# Altium project Pixhawk-BEC-Module.PrjPcb (part 2 of 3)
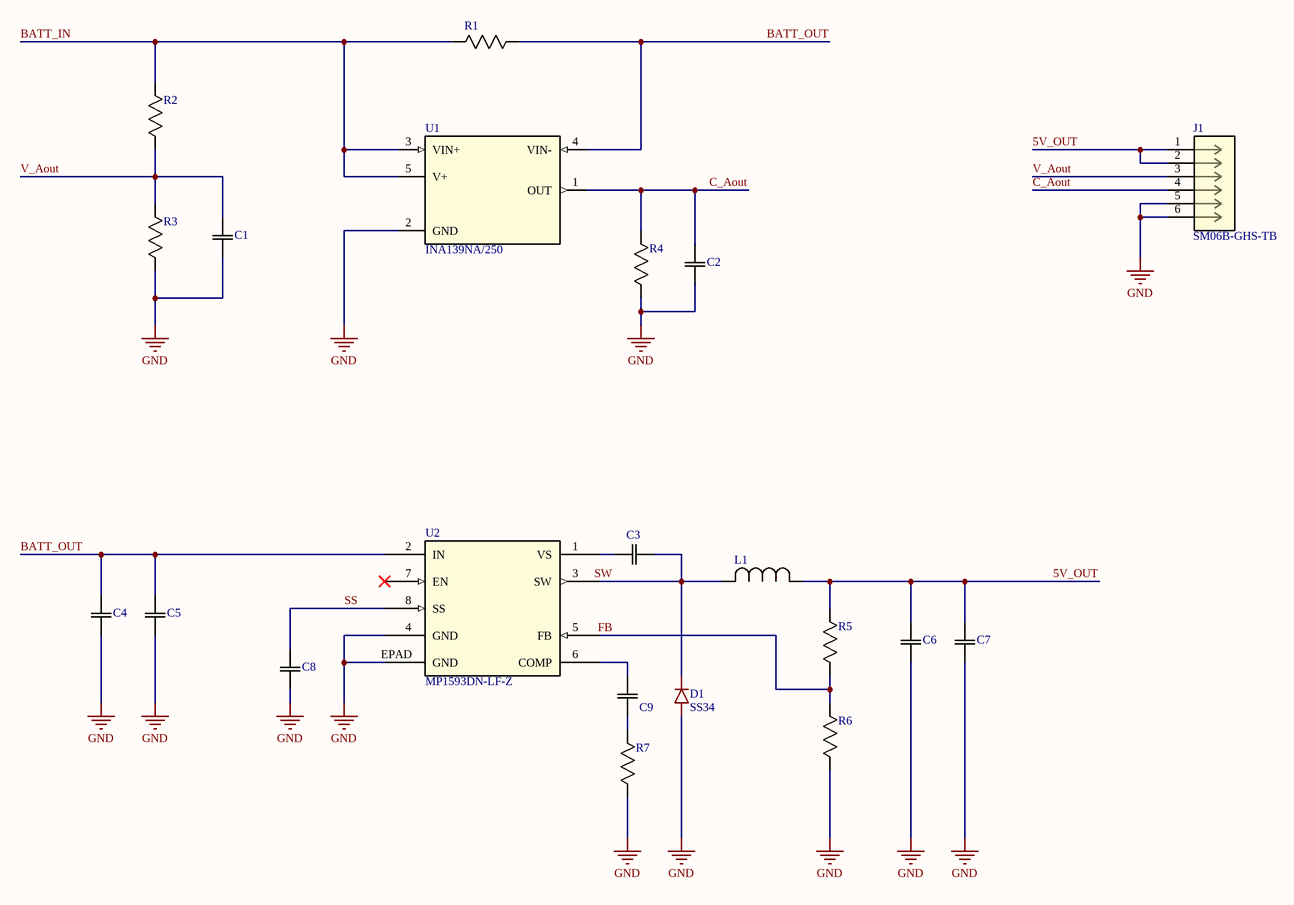
[diagram p1: Sheet1.SchDoc]

## Sheet Sheet1.SchDoc (continued)
### Library data of the parts
C1 C2 C8 = CC0402KRX7R9BB104: 50V 100nF X7R ±10% 0402 Multilayer Ceramic Capacitors MLCC - SMD/SMT ROHS; Manufacturer: Yageo Group; Temperature Coefficient: 30ppm/°C; Supplier: DigiKey; Supplier Part Number: 311-3566-1-ND; Manufacturer Part Number: CC0402KRX7R9BB104; RoHS: Compliant; Category: Ceramic Capacitors; Stock: 948996; Pricing: 1=0.08, 10=0.025, 50=0.0168, 100=0.012, 500=0.01084 (USD); Value: 100nF; Case/Package: 0402; China RoHS: Compliant; Dielectric: X7R; Dielectric Material: Ceramic; Halogen Free: Halogen Free; Height: 500µm; Lead Free: Lead Free; Length: 1mm; Lifecycle Status: Production; Material: Ceramic; Max Operating Temperature: 125°C; Min Operating Temperature: -55°C; Mounting Technology: Surface Mount; Number of Terminals: 2; REACH SVHC: Yes; Schedule B: 8532240020, 8532240020|8532240020, 8532240020|8532240020|8532240020, 8532240020|8532240020|8532240020|8532240020; Thickness: 558.8µm; Tolerance: 10%; Voltage Rating: 50V; Voltage Rating (DC): 50V; Width: 500µm; ComponentLink1URL: https://datasheet.octopart.com:443/CC0402KRX7R9BB104-Yageo-datasheet-177165144.pdf?src-supplier=IHS; ComponentLink1Description: https://datasheet.octopart.com:443/CC0402KRX7R9BB104-Yageo-datasheet-177165144.pdf?src-supplier=IHS; ComponentLink2URL: https://datasheet.octopart.com:443/CC0402KRX7R9BB104-Yageo-datasheet-78855684.pdf?src-supplier=Upverter; ComponentLink2Description: https://datasheet.octopart.com:443/CC0402KRX7R9BB104-Yageo-datasheet-78855684.pdf?src-supplier=Upverter; ComponentLink3URL: https://datasheet.octopart.com:443/CC0402KRX7R9BB104-Yageo-datasheet-181967451.pdf?src-supplier=Newark; ComponentLink3Description: https://datasheet.octopart.com:443/CC0402KRX7R9BB104-Yageo-datasheet-181967451.pdf?src-supplier=Newark; ComponentLink4URL: https://datasheet.octopart.com:443/CC0402KRX7R9BB104-Yageo-datasheet-140260305.pdf?src-supplier=Newark; ComponentLink4Description: https://datasheet.octopart.com:443/CC0402KRX7R9BB104-Yageo-datasheet-140260305.pdf?src-supplier=Newark; ComponentLink5URL: https://datasheet.octopart.com:443/CC0402KRX7R9BB104-Yageo-datasheet-147453679.pdf?src-supplier=Farnell; ComponentLink5Description: https://datasheet.octopart.com:443/CC0402KRX7R9BB104-Yageo-datasheet-147453679.pdf?src-supplier=Farnell; ComponentLink6URL: https://datasheet.octopart.com/CC0402KRX7R9BB104-Yageo-datasheet-10883670.pdf; ComponentLink6Description: https://datasheet.octopart.com/CC0402KRX7R9BB104-Yageo-datasheet-10883670.pdf; ComponentLink7URL: https://datasheet.octopart.com/Surface-Mount-Ceramic-Multilayer-Capacitors%3B-General-Purpose-%26-High-Capacitance-Class-2%2C-X7R-Yageo-datasheet-family-114.pdf; ComponentLink7Description: https://datasheet.octopart.com/Surface-Mount-Ceramic-Multilayer-Capacitors%3B-General-Purpose-%26-High-Capacitance-Class-2%2C-X7R-Yageo-datasheet-family-114.pdf; ComponentLink8URL: https://datasheet.octopart.com:443/CC0402KRX7R9BB104-Yageo-datasheet-166511530.pdf?src-supplier=Future+Electronics; ComponentLink8Description: https://datasheet.octopart.com:443/CC0402KRX7R9BB104-Yageo-datasheet-166511530.pdf?src-supplier=Future+Electronics; ComponentLink9URL: https://datasheet.octopart.com:443/CC0402KRX7R9BB104-Yageo-datasheet-137700082.pdf?src-supplier=Future+Electronics; ComponentLink9Description: https://datasheet.octopart.com:443/CC0402KRX7R9BB104-Yageo-datasheet-137700082.pdf?src-supplier=Future+Electronics; ComponentLink10URL: https://datasheet.octopart.com:443/CC0402KRX7R9BB104-Yageo-datasheet-137700084.pdf?src-supplier=Future+Electronics; ComponentLink10Description: https://datasheet.octopart.com:443/CC0402KRX7R9BB104-Yageo-datasheet-137700084.pdf?src-supplier=Future+Electronics; ComponentLink11URL: https://datasheet.octopart.com:443/CC0402KRX7R9BB104-Yageo-datasheet-42079887.pdf?src-supplier=Future+Electronics; ComponentLink11Description: https://datasheet.octopart.com:443/CC0402KRX7R9BB104-Yageo-datasheet-42079887.pdf?src-supplier=Future+Electronics; ComponentLink12URL: https://datasheet.octopart.com:443/CC0402KRX7R9BB104-Yageo-datasheet-178018857.pdf?src-supplier=Burklin+Elektronik; ComponentLink12Description: https://datasheet.octopart.com:443/CC0402KRX7R9BB104-Yageo-datasheet-178018857.pdf?src-supplier=Burklin+Elektronik; ComponentLink13URL: https://datasheet.octopart.com:443/CC0402KRX7R9BB104-Yageo-Group-datasheet-165992755.pdf?src-supplier=ODG+(Origin+Data+Global); ComponentLink13Description: https://datasheet.octopart.com:443/CC0402KRX7R9BB104-Yageo-Group-datasheet-165992755.pdf?src-supplier=ODG+(Origin+Data+Global); ComponentLink14URL: https://datasheet.octopart.com:443/CC0402KRX7R9BB104-Yageo-datasheet-151948686.pdf?src-supplier=TME; ComponentLink14Description: https://datasheet.octopart.com:443/CC0402KRX7R9BB104-Yageo-datasheet-151948686.pdf?src-supplier=TME; ComponentLink15URL: https://datasheet.octopart.com:443/CC0402KRX7R9BB104-Yageo-datasheet-120101875.pdf?src-supplier=Megastar; ComponentLink15Description: https://datasheet.octopart.com:443/CC0402KRX7R9BB104-Yageo-datasheet-120101875.pdf?src-supplier=Megastar; ComponentLink16URL: http://sigma.octopart.com:80/rohs_statement/Surface-Mount-Ceramic-Multilayer-Capacitors%3B-General-Purpose-%26-High-Capacitance-Class-2%2C-X7R-Yageo-family-124.pdf?src-supplier=Compliance+Statements; ComponentLink16Description: http://sigma.octopart.com:80/rohs_statement/Surface-Mount-Ceramic-Multilayer-Capacitors%3B-General-Purpose-%26-High-Capacitance-Class-2%2C-X7R-Yageo-family-124.pdf?src-supplier=Compliance+Statements; ComponentLink17URL: http://sigma.octopart.com:80/reach_statement/Surface-Mount-Ceramic-Multilayer-Capacitors%3B-General-Purpose-%26-High-Capacitance-Class-2%2C-X7R-Yageo-family-125.pdf?src-supplier=Compliance+Statements; ComponentLink17Description: http://sigma.octopart.com:80/reach_statement/Surface-Mount-Ceramic-Multilayer-Capacitors%3B-General-Purpose-%26-High-Capacitance-Class-2%2C-X7R-Yageo-family-125.pdf?src-supplier=Compliance+Statements; ComponentLink18URL: http://sigma.octopart.com:80/conflict_mineral_statement/Yageo-company-3.pdf?src-supplier=Compliance+Statements; ComponentLink18Description: http://sigma.octopart.com:80/conflict_mineral_statement/Yageo-company-3.pdf?src-supplier=Compliance+Statements; ComponentLink19URL: http://sigma.octopart.com:80/rohs_statement/Yageo-company-2.pdf?src-supplier=Compliance+Statements; ComponentLink19Description: http://sigma.octopart.com:80/rohs_statement/Yageo-company-2.pdf?src-supplier=Compliance+Statements
C3 C9 = C0402C103K5RACTU: Multilayer Ceramic Capacitors MLCC - SMD/SMT 50V 0.01uF X7R 0402 10%; Manufacturer: KEMET; Value: 10nF; Dissipation Factor: 2.5%; Supplier: DigiKey; Supplier Part Number: 399-C0402C103K5RACTUDKR-ND; Manufacturer Part Number: C0402C103K5RACTU; RoHS: Compliant; Category: Ceramic Capacitors; Stock: 1084131; Pricing: 1=0.08, 10=0.004 (USD); Case/Package: 0402; Case Code (Imperial): 0402; China RoHS: Compliant; Depth: 500µm; Dielectric: X7R; Dielectric Material: Ceramic; Height: 500µm; Lead Free: Lead Free; Lead Pitch: 300µm; Length: 1mm; Lifecycle Status: Production; Material: Ceramic; Max Operating Temperature: 125°C; Min Operating Temperature: -55°C; Mounting Technology: Surface Mount; Pins: 2; Number of Terminals: 2; Packaging: Cut Tape; Radiation Hardening: No; REACH SVHC: Yes; Schedule B: 8532240020, 8532240020|8532240020, 8532240020|8532240020|8532240020, 8532240020|8532240020|8532240020|8532240020; Termination: SMD/SMT; Thickness: 558.8µm; Tolerance: 10%; Voltage: 50V; Voltage Rating: 50V; Voltage Rating (AC): 50V; Voltage Rating (DC): 50V; Width: 500µm; ComponentLink1URL: https://datasheet.octopart.com:443/C0402C103K5RAC7867-KEMET-datasheet-179093040.pdf?src-supplier=IHS; ComponentLink1Description: https://datasheet.octopart.com:443/C0402C103K5RAC7867-KEMET-datasheet-179093040.pdf?src-supplier=IHS; ComponentLink2URL: https://datasheet.octopart.com:443/C0402C103K5RACTU-KEMET-datasheet-137357759.pdf?src-supplier=Master+Electronics; ComponentLink2Description: https://datasheet.octopart.com:443/C0402C103K5RACTU-KEMET-datasheet-137357759.pdf?src-supplier=Master+Electronics; ComponentLink3URL: https://datasheet.octopart.com:443/C0402C103K5RACTU-KEMET-datasheet-178445679.pdf?src-supplier=Farnell; ComponentLink3Description: https://datasheet.octopart.com:443/C0402C103K5RACTU-KEMET-datasheet-178445679.pdf?src-supplier=Farnell; ComponentLink4URL: https://datasheet.octopart.com:443/C0402C103K5RACTU-KEMET-datasheet-149521615.pdf?src-supplier=Farnell; ComponentLink4Description: https://datasheet.octopart.com:443/C0402C103K5RACTU-KEMET-datasheet-149521615.pdf?src-supplier=Farnell; ComponentLink5URL: https://datasheet.octopart.com:443/C0402C103K5RACTU-KEMET-datasheet-101575465.pdf?src-supplier=Farnell; ComponentLink5Description: https://datasheet.octopart.com:443/C0402C103K5RACTU-KEMET-datasheet-101575465.pdf?src-supplier=Farnell; ComponentLink6URL: https://datasheet.octopart.com:443/C0402C103K5RACTU-KEMET-datasheet-176142082.pdf?src-supplier=Farnell; ComponentLink6Description: https://datasheet.octopart.com:443/C0402C103K5RACTU-KEMET-datasheet-176142082.pdf?src-supplier=Farnell; ComponentLink7URL: https://datasheet.octopart.com:443/C0402C103K5RACTU-Kemet-datasheet-14356739.pdf?src-supplier=Farnell; ComponentLink7Description: https://datasheet.octopart.com:443/C0402C103K5RACTU-Kemet-datasheet-14356739.pdf?src-supplier=Farnell; ComponentLink8URL: https://datasheet.octopart.com:443/C0402C103K5RAC-TU-Kemet-datasheet-7833651.pdf?src-supplier=Farnell; ComponentLink8Description: https://datasheet.octopart.com:443/C0402C103K5RAC-TU-Kemet-datasheet-7833651.pdf?src-supplier=Farnell; ComponentLink9URL: https://datasheet.octopart.com:443/C0402C103K5RAC-TU-Kemet-datasheet-7601896.pdf?src-supplier=Farnell; ComponentLink9Description: https://datasheet.octopart.com:443/C0402C103K5RAC-TU-Kemet-datasheet-7601896.pdf?src-supplier=Farnell; ComponentLink10URL: https://datasheet.octopart.com:443/C0402C103K5RAC-TU-Kemet-datasheet-5316294.pdf?src-supplier=Farnell; ComponentLink10Description: https://datasheet.octopart.com:443/C0402C103K5RAC-TU-Kemet-datasheet-5316294.pdf?src-supplier=Farnell; ComponentLink11URL: https://datasheet.octopart.com:443/C0402C103K5RAC-TU-Kemet-datasheet-5314837.pdf?src-supplier=Farnell; ComponentLink11Description: https://datasheet.octopart.com:443/C0402C103K5RAC-TU-Kemet-datasheet-5314837.pdf?src-supplier=Farnell; ComponentLink12URL: https://datasheet.octopart.com:443/C0402C103K5RAC-TU-Kemet-datasheet-8092359.pdf?src-supplier=Farnell; ComponentLink12Description: https://datasheet.octopart.com:443/C0402C103K5RAC-TU-Kemet-datasheet-8092359.pdf?src-supplier=Farnell; ComponentLink13URL: https://datasheet.octopart.com:443/C0402C103K5RAC-TU-Kemet-datasheet-5314449.pdf?src-supplier=Farnell; ComponentLink13Description: https://datasheet.octopart.com:443/C0402C103K5RAC-TU-Kemet-datasheet-5314449.pdf?src-supplier=Farnell; ComponentLink14URL: https://datasheet.octopart.com:443/C0402C103K5RAC-TU-Kemet-datasheet-5314969.pdf?src-supplier=Farnell; ComponentLink14Description: https://datasheet.octopart.com:443/C0402C103K5RAC-TU-Kemet-datasheet-5314969.pdf?src-supplier=Farnell; ComponentLink15URL: https://datasheet.octopart.com:443/C0402C103K5RAC-TU-Kemet-datasheet-5314627.pdf?src-supplier=Farnell; ComponentLink15Description: https://datasheet.octopart.com:443/C0402C103K5RAC-TU-Kemet-datasheet-5314627.pdf?src-supplier=Farnell; ComponentLink16URL: https://datasheet.octopart.com:443/C0402C103K5RAC-TU-Kemet-datasheet-5389132.pdf?src-supplier=Farnell; ComponentLink16Description: https://datasheet.octopart.com:443/C0402C103K5RAC-TU-Kemet-datasheet-5389132.pdf?src-supplier=Farnell; ComponentLink17URL: https://datasheet.octopart.com:443/C0402C103K5RAC-TU-Kemet-datasheet-5313836.pdf?src-supplier=Farnell; ComponentLink17Description: https://datasheet.octopart.com:443/C0402C103K5RAC-TU-Kemet-datasheet-5313836.pdf?src-supplier=Farnell; ComponentLink18URL: https://datasheet.octopart.com:443/C0402C103K5RAC-TU-Kemet-datasheet-8111010.pdf?src-supplier=Farnell; ComponentLink18Description: https://datasheet.octopart.com:443/C0402C103K5RAC-TU-Kemet-datasheet-8111010.pdf?src-supplier=Farnell; ComponentLink19URL: https://datasheet.octopart.com:443/C0402C103K5RAC-TU-Kemet-datasheet-7627733.pdf?src-supplier=Farnell; ComponentLink19Description: https://datasheet.octopart.com:443/C0402C103K5RAC-TU-Kemet-datasheet-7627733.pdf?src-supplier=Farnell; ComponentLink20URL: https://datasheet.octopart.com:443/C0402C103K5RACTU-Kemet-datasheet-500041.pdf?src-supplier=Farnell; ComponentLink20Description: https://datasheet.octopart.com:443/C0402C103K5RACTU-Kemet-datasheet-500041.pdf?src-supplier=Farnell; ComponentLink21URL: https://datasheet.octopart.com:443/C0402C103K5RAC-TU-Kemet-datasheet-5315946.pdf?src-supplier=Farnell; ComponentLink21Description: https://datasheet.octopart.com:443/C0402C103K5RAC-TU-Kemet-datasheet-5315946.pdf?src-supplier=Farnell; ComponentLink22URL: https://datasheet.octopart.com:443/C0402C103K5RACTU-KEMET-datasheet-32036385.pdf?src-supplier=Electro+Sonic; ComponentLink22Description: https://datasheet.octopart.com:443/C0402C103K5RACTU-KEMET-datasheet-32036385.pdf?src-supplier=Electro+Sonic; ComponentLink23URL: https://datasheet.octopart.com:443/C0402C103K5RACTU-KEMET-datasheet-157246124.pdf?src-supplier=Electro+Sonic; ComponentLink23Description: https://datasheet.octopart.com:443/C0402C103K5RACTU-KEMET-datasheet-157246124.pdf?src-supplier=Electro+Sonic; ComponentLink24URL: https://datasheet.octopart.com:443/C0402C103K5RAC-TU-Kemet-datasheet-5313890.pdf?src-supplier=Newark; ComponentLink24Description: https://datasheet.octopart.com:443/C0402C103K5RAC-TU-Kemet-datasheet-5313890.pdf?src-supplier=Newark; ComponentLink25URL: https://datasheet.octopart.com:443/C0402C103K5RAC-TU-Kemet-datasheet-5390537.pdf?src-supplier=Newark; ComponentLink25Description: https://datasheet.octopart.com:443/C0402C103K5RAC-TU-Kemet-datasheet-5390537.pdf?src-supplier=Newark; ComponentLink26URL: https://datasheet.octopart.com:443/C0402C103K5RAC-TU-Kemet-datasheet-7541751.pdf?src-supplier=Newark; ComponentLink26Description: https://datasheet.octopart.com:443/C0402C103K5RAC-TU-Kemet-datasheet-7541751.pdf?src-supplier=Newark; ComponentLink27URL: https://datasheet.octopart.com:443/C0402C103K5RACTU-KEMET-datasheet-168262798.pdf?src-supplier=Newark; ComponentLink27Description: https://datasheet.octopart.com:443/C0402C103K5RACTU-KEMET-datasheet-168262798.pdf?src-supplier=Newark; ComponentLink28URL: https://datasheet.octopart.com:443/C0402C103K5RACTU-KEMET-datasheet-130256537.pdf?src-supplier=Newark; ComponentLink28Description: https://datasheet.octopart.com:443/C0402C103K5RACTU-KEMET-datasheet-130256537.pdf?src-supplier=Newark; ComponentLink29URL: https://datasheet.octopart.com:443/C0402C103K5RACTU-Kemet-datasheet-8764837.pdf?src-supplier=Newark; ComponentLink29Description: https://datasheet.octopart.com:443/C0402C103K5RACTU-Kemet-datasheet-8764837.pdf?src-supplier=Newark; ComponentLink30URL: https://datasheet.octopart.com:443/C0402C103K5RACTU-Kemet-datasheet-8480123.pdf?src-supplier=Newark; ComponentLink30Description: https://datasheet.octopart.com:443/C0402C103K5RACTU-Kemet-datasheet-8480123.pdf?src-supplier=Newark; ComponentLink31URL: https://datasheet.octopart.com:443/C0402C103K5RACTU-Kemet-datasheet-5393970.pdf?src-supplier=Newark; ComponentLink31Description: https://datasheet.octopart.com:443/C0402C103K5RACTU-Kemet-datasheet-5393970.pdf?src-supplier=Newark; ComponentLink32URL: https://datasheet.octopart.com:443/C0402C103K5RACTU-Kemet-datasheet-8502025.pdf?src-supplier=Newark; ComponentLink32Description: https://datasheet.octopart.com:443/C0402C103K5RACTU-Kemet-datasheet-8502025.pdf?src-supplier=Newark; ComponentLink33URL: https://datasheet.octopart.com:443/C0402C103K5RACTU-Kemet-datasheet-161801.pdf?src-supplier=Newark; ComponentLink33Description: https://datasheet.octopart.com:443/C0402C103K5RACTU-Kemet-datasheet-161801.pdf?src-supplier=Newark; ComponentLink34URL: https://datasheet.octopart.com:443/C0402C103K5RACTU-Kemet-datasheet-12608295.pdf?src-supplier=element14+APAC; ComponentLink34Description: https://datasheet.octopart.com:443/C0402C103K5RACTU-Kemet-datasheet-12608295.pdf?src-supplier=element14+APAC; ComponentLink35URL: https://datasheet.octopart.com:443/C0402C103K5RACTU-Kemet-datasheet-11992184.pdf?src-supplier=element14+APAC; ComponentLink35Description: https://datasheet.octopart.com:443/C0402C103K5RACTU-Kemet-datasheet-11992184.pdf?src-supplier=element14+APAC; ComponentLink36URL: https://datasheet.octopart.com:443/C0402C103K5RACTU-Kemet-datasheet-10942409.pdf?src-supplier=element14+APAC; ComponentLink36Description: https://datasheet.octopart.com:443/C0402C103K5RACTU-Kemet-datasheet-10942409.pdf?src-supplier=element14+APAC; ComponentLink37URL: https://datasheet.octopart.com:443/C0402C103K5RACTU-Kemet-datasheet-10404442.pdf?src-supplier=element14+APAC; ComponentLink37Description: https://datasheet.octopart.com:443/C0402C103K5RACTU-Kemet-datasheet-10404442.pdf?src-supplier=element14+APAC; ComponentLink38URL: https://datasheet.octopart.com:443/C0402C103K5RACTU-KEMET-datasheet-164512540.pdf?src-supplier=TME; ComponentLink38Description: https://datasheet.octopart.com:443/C0402C103K5RACTU-KEMET-datasheet-164512540.pdf?src-supplier=TME; ComponentLink39URL: https://datasheet.octopart.com:443/C0402C103K5RACTU-Kemet-datasheet-67501989.pdf?src-supplier=TME; ComponentLink39Description: https://datasheet.octopart.com:443/C0402C103K5RACTU-Kemet-datasheet-67501989.pdf?src-supplier=TME; ComponentLink40URL: https://datasheet.octopart.com:443/C0402C103K5RACTU-KEMET-datasheet-68331906.pdf?src-supplier=TME; ComponentLink40Description: https://datasheet.octopart.com:443/C0402C103K5RACTU-KEMET-datasheet-68331906.pdf?src-supplier=TME; ComponentLink41URL: https://datasheet.octopart.com:443/C0402C103K5RAC7867-Kemet-datasheet-62098571.pdf?src-supplier=TME; ComponentLink41Description: https://datasheet.octopart.com:443/C0402C103K5RAC7867-Kemet-datasheet-62098571.pdf?src-supplier=TME; ComponentLink42URL: https://datasheet.octopart.com:443/C0402C103K5RACTU-KEMET-datasheet-110724412.pdf?src-supplier=RS+(Formerly+Allied+Electronics); ComponentLink42Description: https://datasheet.octopart.com:443/C0402C103K5RACTU-KEMET-datasheet-110724412.pdf?src-supplier=RS+(Formerly+Allied+Electronics); ComponentLink43URL: https://datasheet.octopart.com:443/C0402C103K5RACTU-Kemet-datasheet-464.pdf?src-supplier=RS+(Formerly+Allied+Electronics); ComponentLink43Description: https://datasheet.octopart.com:443/C0402C103K5RACTU-Kemet-datasheet-464.pdf?src-supplier=RS+(Formerly+Allied+Electronics); ComponentLink44URL: https://datasheet.octopart.com/C0402C103K5RACTU-KEMET-datasheet-84169754.pdf; ComponentLink44Description: https://datasheet.octopart.com/C0402C103K5RACTU-KEMET-datasheet-84169754.pdf; ComponentLink45URL: https://datasheet.octopart.com:443/C0402C103K5RACTU-Kemet-datasheet-11859415.pdf?src-supplier=Arrow+Electronics; ComponentLink45Description: https://datasheet.octopart.com:443/C0402C103K5RACTU-Kemet-datasheet-11859415.pdf?src-supplier=Arrow+Electronics; ComponentLink46URL: https://datasheet.octopart.com:443/C0402C103K5RAC-TU-Kemet-datasheet-7597978.pdf?src-supplier=Jameco; ComponentLink46Description: https://datasheet.octopart.com:443/C0402C103K5RAC-TU-Kemet-datasheet-7597978.pdf?src-supplier=Jameco
C4 C5 = CC1210KKX7R9BB106: 50V 10uF X7R ±10% 1210 Multilayer Ceramic Capacitors MLCC - SMD/SMT ROHS; Manufacturer: Yageo Group; Value: 10µF; Supplier: DigiKey; Supplier Part Number: 311-2035-1-ND; Manufacturer Part Number: CC1210KKX7R9BB106; RoHS: Compliant; Category: Ceramic Capacitors; Stock: 63195; Pricing: 1=0.66, 10=0.412, 50=0.3138, 100=0.2835 (USD); Case/Package: 1210; Case Code (Imperial): 1210; Case Code (Metric): 3225; China RoHS: Compliant; Dielectric: X7R; Dielectric Material: Ceramic; Halogen Free: Halogen Free; Height: 2.5mm; Lead Free: Lead Free; Length: 3.2mm; Lifecycle Status: Production; Max Operating Temperature: 125°C; Min Operating Temperature: -55°C; Mounting Technology: Surface Mount; Number of Terminals: 2; Packaging: Tape & Reel (TR); REACH SVHC: Yes; Schedule B: 8532240020, 8532240020|8532240020, 8532240020|8532240020|8532240020, 8532240020|8532240020|8532240020|8532240020; Thickness: 2.794mm; Tolerance: 10%; Voltage Rating: 50V; Voltage Rating (DC): 50V; Width: 2.5mm; ComponentLink1URL: https://datasheet.octopart.com:443/CC1210KKX7R9BB106-Yageo-datasheet-177165144.pdf?src-supplier=IHS; ComponentLink1Description: https://datasheet.octopart.com:443/CC1210KKX7R9BB106-Yageo-datasheet-177165144.pdf?src-supplier=IHS; ComponentLink2URL: https://datasheet.octopart.com:443/CC1210KKX7R9BB106-Yageo-Group-datasheet-189192896.pdf?src-supplier=TME; ComponentLink2Description: https://datasheet.octopart.com:443/CC1210KKX7R9BB106-Yageo-Group-datasheet-189192896.pdf?src-supplier=TME; ComponentLink3URL: https://datasheet.octopart.com:443/CC1210KKX7R9BB106-Yageo-Group-datasheet-188192968.pdf?src-supplier=Newark; ComponentLink3Description: https://datasheet.octopart.com:443/CC1210KKX7R9BB106-Yageo-Group-datasheet-188192968.pdf?src-supplier=Newark; ComponentLink4URL: https://datasheet.octopart.com:443/CC1210KKX7R9BB106-Yageo-datasheet-147453679.pdf?src-supplier=Farnell; ComponentLink4Description: https://datasheet.octopart.com:443/CC1210KKX7R9BB106-Yageo-datasheet-147453679.pdf?src-supplier=Farnell; ComponentLink5URL: https://datasheet.octopart.com:443/CC1210KKX7R9BB106-Yageo-datasheet-182030352.pdf?src-supplier=Farnell; ComponentLink5Description: https://datasheet.octopart.com:443/CC1210KKX7R9BB106-Yageo-datasheet-182030352.pdf?src-supplier=Farnell; ComponentLink6URL: https://datasheet.octopart.com:443/CC1210KKX7R9BB106-Yageo-datasheet-182030351.pdf?src-supplier=Farnell; ComponentLink6Description: https://datasheet.octopart.com:443/CC1210KKX7R9BB106-Yageo-datasheet-182030351.pdf?src-supplier=Farnell; ComponentLink7URL: https://datasheet.octopart.com:443/CC1210KKX7R9BB106-Yageo-Group-datasheet-188689702.pdf?src-supplier=Farnell; ComponentLink7Description: https://datasheet.octopart.com:443/CC1210KKX7R9BB106-Yageo-Group-datasheet-188689702.pdf?src-supplier=Farnell; ComponentLink8URL: https://datasheet.octopart.com:443/CC1210KKX7R9BB106-Yageo-datasheet-151948686.pdf?src-supplier=Farnell; ComponentLink8Description: https://datasheet.octopart.com:443/CC1210KKX7R9BB106-Yageo-datasheet-151948686.pdf?src-supplier=Farnell; ComponentLink9URL: https://datasheet.octopart.com:443/CC1210KKX7R9BB106-Yageo-datasheet-166511530.pdf?src-supplier=Future+Electronics; ComponentLink9Description: https://datasheet.octopart.com:443/CC1210KKX7R9BB106-Yageo-datasheet-166511530.pdf?src-supplier=Future+Electronics; ComponentLink10URL: https://datasheet.octopart.com:443/CC1210KKX7R9BB106-Yageo-datasheet-137700084.pdf?src-supplier=Future+Electronics; ComponentLink10Description: https://datasheet.octopart.com:443/CC1210KKX7R9BB106-Yageo-datasheet-137700084.pdf?src-supplier=Future+Electronics; ComponentLink11URL: https://datasheet.octopart.com:443/CC1210KKX7R9BB106-Yageo-datasheet-42079887.pdf?src-supplier=Future+Electronics; ComponentLink11Description: https://datasheet.octopart.com:443/CC1210KKX7R9BB106-Yageo-datasheet-42079887.pdf?src-supplier=Future+Electronics; ComponentLink12URL: https://datasheet.octopart.com:443/CC1210KKX7R9BB106-Yageo-datasheet-27626582.pdf?src-supplier=Future+Electronics; ComponentLink12Description: https://datasheet.octopart.com:443/CC1210KKX7R9BB106-Yageo-datasheet-27626582.pdf?src-supplier=Future+Electronics; ComponentLink13URL: https://datasheet.octopart.com:443/CC1210KKX7R9BB106-Yageo-datasheet-10406438.pdf?src-supplier=Future+Electronics; ComponentLink13Description: https://datasheet.octopart.com:443/CC1210KKX7R9BB106-Yageo-datasheet-10406438.pdf?src-supplier=Future+Electronics; ComponentLink14URL: https://datasheet.octopart.com:443/CC1210KKX7R9BB106-Yageo-Group-datasheet-165992755.pdf?src-supplier=ODG+(Origin+Data+Global); ComponentLink14Description: https://datasheet.octopart.com:443/CC1210KKX7R9BB106-Yageo-Group-datasheet-165992755.pdf?src-supplier=ODG+(Origin+Data+Global); ComponentLink15URL: https://datasheet.octopart.com/Surface-Mount-Ceramic-Multilayer-Capacitors%3B-General-Purpose-%26-High-Capacitance-Class-2%2C-X7R-Yageo-datasheet-family-114.pdf; ComponentLink15Description: https://datasheet.octopart.com/Surface-Mount-Ceramic-Multilayer-Capacitors%3B-General-Purpose-%26-High-Capacitance-Class-2%2C-X7R-Yageo-datasheet-family-114.pdf; ComponentLink16URL: https://datasheet.octopart.com/CC1210KKX7R9BB106-Yageo-datasheet-10883670.pdf; ComponentLink16Description: https://datasheet.octopart.com/CC1210KKX7R9BB106-Yageo-datasheet-10883670.pdf; ComponentLink17URL: http://sigma.octopart.com:80/rohs_statement/Surface-Mount-Ceramic-Multilayer-Capacitors%3B-General-Purpose-%26-High-Capacitance-Class-2%2C-X7R-Yageo-family-124.pdf?src-supplier=Compliance+Statements; ComponentLink17Description: http://sigma.octopart.com:80/rohs_statement/Surface-Mount-Ceramic-Multilayer-Capacitors%3B-General-Purpose-%26-High-Capacitance-Class-2%2C-X7R-Yageo-family-124.pdf?src-supplier=Compliance+Statements; ComponentLink18URL: http://sigma.octopart.com:80/reach_statement/Surface-Mount-Ceramic-Multilayer-Capacitors%3B-General-Purpose-%26-High-Capacitance-Class-2%2C-X7R-Yageo-family-125.pdf?src-supplier=Compliance+Statements; ComponentLink18Description: http://sigma.octopart.com:80/reach_statement/Surface-Mount-Ceramic-Multilayer-Capacitors%3B-General-Purpose-%26-High-Capacitance-Class-2%2C-X7R-Yageo-family-125.pdf?src-supplier=Compliance+Statements; ComponentLink19URL: http://sigma.octopart.com:80/rohs_statement/Yageo-company-2.pdf?src-supplier=Compliance+Statements; ComponentLink19Description: http://sigma.octopart.com:80/rohs_statement/Yageo-company-2.pdf?src-supplier=Compliance+Statements; ComponentLink20URL: http://sigma.octopart.com:80/conflict_mineral_statement/Yageo-company-3.pdf?src-supplier=Compliance+Statements; ComponentLink20Description: http://sigma.octopart.com:80/conflict_mineral_statement/Yageo-company-3.pdf?src-supplier=Compliance+Statements
C6 C7 = GRM32ER71E226ME15L: 22 µF ±20% 25V Ceramic Capacitor X7R 1210 (3225 Metric); Manufacturer_Name: Murata; Type: Ceramic Capacitors; Copyright: Copyright (C) 2025 Ultra Librarian. All rights reserved.; Manufacturer_Part_Number: GRM32ER71E226ME15L
D1 = SS34: Diode 40 V 3A Surface Mount DO-214AB (SMC); Manufacturer_Name: onsemi; Copyright: Copyright (C) 2025 Ultra Librarian. All rights reserved.; Manufacturer_Part_Number: SS34; RefDes: RefDes; Type: Type
J1 = SM06B-GHS-TB: Connector Header Surface Mount, Right Angle 6 position 0.049" (1.25mm); Manufacturer_Name: JST; Copyright: Copyright (C) 2025 Ultra Librarian. All rights reserved.; Manufacturer_Part_Number: SM06B-GHS-TB; RefDes: RefDes; Type: Type
L1 = SRR1260-150M: 15 µH Shielded Drum Core, Wirewound Inductor 5 A 27mOhm Max Nonstandard; Manufacturer_Name: Bourns Electronics; Copyright: Copyright (C) 2025 Ultra Librarian. All rights reserved.; Manufacturer_Part_Number: SRR1260-150M
R1 = PA2512FKE7T0U5E: 500 µOhms ±1% 3W Chip Resistor 2512 (6332 Metric) Anti-Sulfur, Automotive AEC-Q200, Current Sense, Moisture Resistant Metal Element; Manufacturer_Name: Yageo; Copyright: Copyright (C) 2025 Ultra Librarian. All rights reserved.; Manufacturer_Part_Number: PA2512FKE7T0U5E
R2 = ERJ-2RKF1372X: Res Thick Film 0402 13.7K Ohm 1% 0.1W ±100ppm/°C Molded SMD Punched Carrier T/R; Manufacturer: Panasonic; Max Power Dissipation: 100mW; Value: 13.7kΩ; Voltage Rating: 50V; Supplier: DigiKey; Supplier Part Number: P13.7KLCT-ND; Manufacturer Part Number: ERJ-2RKF1372X; RoHS: Compliant; Category: Chip SMD Resistors; Stock: 67326; Pricing: 1=0.1, 10=0.028, 25=0.0208, 50=0.0168, 100=0.0138, 250=0.01072, 500=0.009, 1000=0.00766, 5000=0.00554 (USD); Case/Package: 0402; Case Code (Imperial): 0402; China RoHS: Non-Compliant; Composition: Thick Film; Contact Plating: Tin; Depth: 500µm; Features: Automotive AEC-Q200; Height: 350µm; Lead Free: Lead Free; Length: 1mm; Lifecycle Status: Production; Max Operating Temperature: 155°C; Military Standard: Not; Min Operating Temperature: -55°C; Mounting Technology: Surface Mount; Number of Terminals: 2; Number of Terminations: 2; Packaging: Cut Tape; Power Dissipation: 100mW; Power Rating: 100mW; REACH SVHC: Yes; Schedule B: 8533210045, 8533210045|8533210045|8533210045|8533210045|8533210045; Temperature Coefficient: 100ppm/°C; Termination: SMD/SMT; Tolerance: 1%; Voltage Rating (DC): 50V; Weight: 793.786648µg; Width: 500µm; Working Voltage: 50V; ComponentLink1URL: https://sigma.octopart.com:443/138766958/technical_drawing/Panasonic-ERJ-2RKF1372X.pdf?src-supplier=Upverter; ComponentLink1Description: https://sigma.octopart.com:443/138766958/technical_drawing/Panasonic-ERJ-2RKF1372X.pdf?src-supplier=Upverter; ComponentLink2URL: https://datasheet.octopart.com:443/ERJ-2RKF1372X-Panasonic-datasheet-82288794.pdf?src-supplier=Panasonic+SCT; ComponentLink2Description: https://datasheet.octopart.com:443/ERJ-2RKF1372X-Panasonic-datasheet-82288794.pdf?src-supplier=Panasonic+SCT; ComponentLink3URL: https://datasheet.octopart.com:443/ERJ-2RKF1372X-Panasonic-datasheet-48891056.pdf?src-supplier=Newark; ComponentLink3Description: https://datasheet.octopart.com:443/ERJ-2RKF1372X-Panasonic-datasheet-48891056.pdf?src-supplier=Newark; ComponentLink4URL: https://datasheet.octopart.com:443/ERJ-2RKF1372X-Panasonic-datasheet-136608610.pdf?src-supplier=Newark; ComponentLink4Description: https://datasheet.octopart.com:443/ERJ-2RKF1372X-Panasonic-datasheet-136608610.pdf?src-supplier=Newark; ComponentLink5URL: https://datasheet.octopart.com:443/ERJ-2RKF1372X-Panasonic-datasheet-33006990.pdf?src-supplier=Newark; ComponentLink5Description: https://datasheet.octopart.com:443/ERJ-2RKF1372X-Panasonic-datasheet-33006990.pdf?src-supplier=Newark; ComponentLink6URL: https://datasheet.octopart.com:443/ERJ-2RKF1372X-Panasonic---ECG-datasheet-21211697.pdf?src-supplier=Newark; ComponentLink6Description: https://datasheet.octopart.com:443/ERJ-2RKF1372X-Panasonic---ECG-datasheet-21211697.pdf?src-supplier=Newark; ComponentLink7URL: https://datasheet.octopart.com:443/ERJ-2RKF1372X-Panasonic-datasheet-13266541.pdf?src-supplier=Farnell; ComponentLink7Description: https://datasheet.octopart.com:443/ERJ-2RKF1372X-Panasonic-datasheet-13266541.pdf?src-supplier=Farnell; ComponentLink8URL: https://datasheet.octopart.com:443/ERJ-2RKF1372X-Panasonic---ECG-datasheet-15994758.pdf?src-supplier=Farnell; ComponentLink8Description: https://datasheet.octopart.com:443/ERJ-2RKF1372X-Panasonic---ECG-datasheet-15994758.pdf?src-supplier=Farnell; ComponentLink9URL: https://datasheet.octopart.com:443/ERJ-2RKF1372X-Panasonic---ECG-datasheet-10025800.pdf?src-supplier=Farnell; ComponentLink9Description: https://datasheet.octopart.com:443/ERJ-2RKF1372X-Panasonic---ECG-datasheet-10025800.pdf?src-supplier=Farnell; ComponentLink10URL: https://datasheet.octopart.com:443/ERJ-2RKF1372X-Panasonic---ECG-datasheet-8853621.pdf?src-supplier=Farnell; ComponentLink10Description: https://datasheet.octopart.com:443/ERJ-2RKF1372X-Panasonic---ECG-datasheet-8853621.pdf?src-supplier=Farnell; ComponentLink11URL: https://datasheet.octopart.com:443/ERJ-2RKF1372X-Panasonic---ECG-datasheet-5313456.pdf?src-supplier=Farnell; ComponentLink11Description: https://datasheet.octopart.com:443/ERJ-2RKF1372X-Panasonic---ECG-datasheet-5313456.pdf?src-supplier=Farnell; ComponentLink12URL: https://datasheet.octopart.com:443/ERJ-2RKF1372X-Panasonic-datasheet-154766169.pdf?src-supplier=JRH+Electronics; ComponentLink12Description: https://datasheet.octopart.com:443/ERJ-2RKF1372X-Panasonic-datasheet-154766169.pdf?src-supplier=JRH+Electronics; ComponentLink13URL: https://datasheet.octopart.com:443/ERJ2RKF1372X-Panasonic-datasheet-188592431.pdf?src-supplier=TME; ComponentLink13Description: https://datasheet.octopart.com:443/ERJ2RKF1372X-Panasonic-datasheet-188592431.pdf?src-supplier=TME; ComponentLink14URL: https://datasheet.octopart.com:443/ERJ2RKF1372X-Panasonic-datasheet-164353789.pdf?src-supplier=TME; ComponentLink14Description: https://datasheet.octopart.com:443/ERJ2RKF1372X-Panasonic-datasheet-164353789.pdf?src-supplier=TME; ComponentLink15URL: https://datasheet.octopart.com/ERJ-2RKF1372X-Panasonic-datasheet-78375410.pdf; ComponentLink15Description: https://datasheet.octopart.com/ERJ-2RKF1372X-Panasonic-datasheet-78375410.pdf; ComponentLink16URL: https://datasheet.octopart.com/Precision-Thick-Film-Chip-Resistors-Panasonic-datasheet-family-106.pdf; ComponentLink16Description: https://datasheet.octopart.com/Precision-Thick-Film-Chip-Resistors-Panasonic-datasheet-family-106.pdf; ComponentLink17URL: https://datasheet.octopart.com:443/ERJ-2RKF1372X-Panasonic-datasheet-118621.pdf?src-supplier=DigiKey; ComponentLink17Description: https://datasheet.octopart.com:443/ERJ-2RKF1372X-Panasonic-datasheet-118621.pdf?src-supplier=DigiKey; ComponentLink18URL: https://datasheet.octopart.com:443/ERJ-2RKF1372X-Panasonic-datasheet-41391857.pdf?src-supplier=Electro+Sonic; ComponentLink18Description: https://datasheet.octopart.com:443/ERJ-2RKF1372X-Panasonic-datasheet-41391857.pdf?src-supplier=Electro+Sonic; ComponentLink19URL: https://datasheet.octopart.com:443/ERJ-2RKF1372X-Panasonic-datasheet-38423196.pdf?src-supplier=Future+Electronics; ComponentLink19Description: https://datasheet.octopart.com:443/ERJ-2RKF1372X-Panasonic-datasheet-38423196.pdf?src-supplier=Future+Electronics
R3 = ERJ-2GEJ152X: Res Thick Film 0402 1.5K Ohm 5% 0.1W(1/10W) +/-200ppm/ßC SMD Automotive T/R; Manufacturer: Panasonic; Max Power Dissipation: 100mW; Value: 1.5kΩ; Temperature Coefficient: 200ppm/°C; Voltage Rating: 50V; Supplier: DigiKey; Supplier Part Number: P1.5KJCT-ND; Manufacturer Part Number: ERJ-2GEJ152X; RoHS: Compliant; Category: Chip SMD Resistors; Stock: 1074709; Pricing: 1=0.1, 10=0.026, 25=0.0192, 50=0.0154, 100=0.0125, 250=0.00932, 500=0.00808, 1000=0.00685, 5000=0.0049 (USD); Case/Package: 0402; Case Code (Imperial): 0402; Composition: Thick Film; Contact Plating: Tin; Depth: 500µm; Features: Automotive AEC-Q200; Height: 350µm; Length: 1mm; Lifecycle Status: Production; Max Operating Temperature: 155°C; Military Standard: Not; Min Operating Temperature: -55°C; Mounting Technology: Surface Mount; Pins: 2; Number of Terminals: 2; Number of Terminations: 2; Packaging: Cut Tape; Power Dissipation: 100mW; Power Rating: 100mW; Radiation Hardening: No; REACH SVHC: Yes; Schedule B: 8533210045, 8533210045|8533210045|8533210045|8533210045|8533210045; Termination: SMD/SMT; Tolerance: 5%; Voltage Rating (DC): 50V; Weight: 793.786648µg; Width: 500µm; Working Voltage: 50V; ComponentLink1URL: https://sigma.octopart.com:443/138766958/technical_drawing/Panasonic-ERJ-2GEJ152X.pdf?src-supplier=Upverter; ComponentLink1Description: https://sigma.octopart.com:443/138766958/technical_drawing/Panasonic-ERJ-2GEJ152X.pdf?src-supplier=Upverter; ComponentLink2URL: https://datasheet.octopart.com:443/ERJ-2GEJ152X-Panasonic-datasheet-61114972.pdf?src-supplier=Newark; ComponentLink2Description: https://datasheet.octopart.com:443/ERJ-2GEJ152X-Panasonic-datasheet-61114972.pdf?src-supplier=Newark; ComponentLink3URL: https://datasheet.octopart.com:443/ERJ-2GEJ152X-Panasonic-datasheet-13266872.pdf?src-supplier=Newark; ComponentLink3Description: https://datasheet.octopart.com:443/ERJ-2GEJ152X-Panasonic-datasheet-13266872.pdf?src-supplier=Newark; ComponentLink4URL: https://datasheet.octopart.com:443/ERJ-2GEJ152X-Panasonic-datasheet-136608608.pdf?src-supplier=Newark; ComponentLink4Description: https://datasheet.octopart.com:443/ERJ-2GEJ152X-Panasonic-datasheet-136608608.pdf?src-supplier=Newark; ComponentLink5URL: https://datasheet.octopart.com:443/ERJ-2GEJ152X-Panasonic-datasheet-164353788.pdf?src-supplier=Newark; ComponentLink5Description: https://datasheet.octopart.com:443/ERJ-2GEJ152X-Panasonic-datasheet-164353788.pdf?src-supplier=Newark; ComponentLink6URL: https://datasheet.octopart.com:443/ERJ-2GEJ152X-Panasonic-datasheet-5314550.pdf?src-supplier=Jameco; ComponentLink6Description: https://datasheet.octopart.com:443/ERJ-2GEJ152X-Panasonic-datasheet-5314550.pdf?src-supplier=Jameco; ComponentLink7URL: https://datasheet.octopart.com:443/ERJ-2GEJ152X-Panasonic-datasheet-147443676.pdf?src-supplier=JRH+Electronics; ComponentLink7Description: https://datasheet.octopart.com:443/ERJ-2GEJ152X-Panasonic-datasheet-147443676.pdf?src-supplier=JRH+Electronics; ComponentLink8URL: https://datasheet.octopart.com:443/ERJ-2GEJ152X-Panasonic-datasheet-10554283.pdf?src-supplier=element14+APAC; ComponentLink8Description: https://datasheet.octopart.com:443/ERJ-2GEJ152X-Panasonic-datasheet-10554283.pdf?src-supplier=element14+APAC; ComponentLink9URL: https://datasheet.octopart.com:443/ERJ2GEJ152X-Panasonic-datasheet-165581512.pdf?src-supplier=TME; ComponentLink9Description: https://datasheet.octopart.com:443/ERJ2GEJ152X-Panasonic-datasheet-165581512.pdf?src-supplier=TME; ComponentLink10URL: https://datasheet.octopart.com:443/ERJ-2GEJ152X-Panasonic-datasheet-137472382.pdf?src-supplier=LKR; ComponentLink10Description: https://datasheet.octopart.com:443/ERJ-2GEJ152X-Panasonic-datasheet-137472382.pdf?src-supplier=LKR; ComponentLink11URL: https://datasheet.octopart.com/ERJ-2GEJ152X-Panasonic-datasheet-78375410.pdf; ComponentLink11Description: https://datasheet.octopart.com/ERJ-2GEJ152X-Panasonic-datasheet-78375410.pdf; ComponentLink12URL: https://datasheet.octopart.com/Thick-Film-Chip-Resistors-Panasonic-datasheet-family-105.pdf; ComponentLink12Description: https://datasheet.octopart.com/Thick-Film-Chip-Resistors-Panasonic-datasheet-family-105.pdf; ComponentLink13URL: https://datasheet.octopart.com:443/ERJ-2GEJ152X-Panasonic---ECG-datasheet-15994758.pdf?src-supplier=Farnell; ComponentLink13Description: https://datasheet.octopart.com:443/ERJ-2GEJ152X-Panasonic---ECG-datasheet-15994758.pdf?src-supplier=Farnell; ComponentLink14URL: https://datasheet.octopart.com:443/ERJ-2GEJ152X-Panasonic-datasheet-5313456.pdf?src-supplier=Farnell; ComponentLink14Description: https://datasheet.octopart.com:443/ERJ-2GEJ152X-Panasonic-datasheet-5313456.pdf?src-supplier=Farnell; ComponentLink15URL: https://datasheet.octopart.com:443/ERJ-2GEJ152X-Panasonic-datasheet-118598.pdf?src-supplier=DigiKey; ComponentLink15Description: https://datasheet.octopart.com:443/ERJ-2GEJ152X-Panasonic-datasheet-118598.pdf?src-supplier=DigiKey; ComponentLink16URL: https://datasheet.octopart.com:443/ERJ2GEJ152X-Panasonic-datasheet-27908757.pdf?src-supplier=Electro+Sonic; ComponentLink16Description: https://datasheet.octopart.com:443/ERJ2GEJ152X-Panasonic-datasheet-27908757.pdf?src-supplier=Electro+Sonic; ComponentLink17URL: https://datasheet.octopart.com:443/ERJ-2GEJ152X-Panasonic-datasheet-37173568.pdf?src-supplier=Electro+Sonic; ComponentLink17Description: https://datasheet.octopart.com:443/ERJ-2GEJ152X-Panasonic-datasheet-37173568.pdf?src-supplier=Electro+Sonic
R4 = ERJ-2GEJ104X: Res Thick Film 0402 100K Ohm 5% 0.1W(1/10W) +/-200ppm/ßC SMD Automotive T/R; Manufacturer: Panasonic; Max Power Dissipation: 100mW; Value: 100kΩ; Temperature Coefficient: 200ppm/°C; Voltage Rating: 50V; Supplier: DigiKey; Supplier Part Number: P100KJCT-ND; Manufacturer Part Number: ERJ-2GEJ104X; RoHS: Compliant; Category: Chip SMD Resistors; Stock: 589546; Pricing: 1=0.1, 10=0.026, 25=0.0192, 50=0.0154, 100=0.0125, 250=0.00968, 500=0.00808, 1000=0.00685, 5000=0.0049 (USD); Case/Package: 0402; Case Code (Imperial): 0402; China RoHS: Non-Compliant; Composition: Thick Film; Contact Plating: Tin; Depth: 500µm; Features: Automotive AEC-Q200; Height: 350µm; Length: 1mm; Lifecycle Status: Production; Max Operating Temperature: 155°C; Military Standard: Not; Min Operating Temperature: -55°C; Mounting Technology: Surface Mount; Number of Terminals: 2; Number of Terminations: 2; Packaging: Cut Tape; Power Dissipation: 100mW; Power Rating: 100mW; Radiation Hardening: No; REACH SVHC: Yes; Schedule B: 8533210045, 8533210045|8533210045|8533210045|8533210045|8533210045|8533210045|8533210045|8533210045|8533210045|8533210045|8533210045|8533210045|8533210045|8533210045|8533210045|8533210045|8533210045|8533210045|8533210045|8533210045|8533210045|8533210045|8533210045|85; Termination: SMD/SMT; Tolerance: 5%; Voltage Rating (DC): 50V; Width: 500µm; Working Voltage: 50V; ComponentLink1URL: https://datasheet.octopart.com:443/ERJ-2GEJ104X-Panasonic-datasheet-61114972.pdf?src-supplier=Newark; ComponentLink1Description: https://datasheet.octopart.com:443/ERJ-2GEJ104X-Panasonic-datasheet-61114972.pdf?src-supplier=Newark; ComponentLink2URL: https://datasheet.octopart.com:443/ERJ-2GEJ104X-Panasonic-datasheet-13266872.pdf?src-supplier=Newark; ComponentLink2Description: https://datasheet.octopart.com:443/ERJ-2GEJ104X-Panasonic-datasheet-13266872.pdf?src-supplier=Newark; ComponentLink3URL: https://datasheet.octopart.com:443/ERJ-2GEJ104X-Panasonic-datasheet-10554283.pdf?src-supplier=Newark; ComponentLink3Description: https://datasheet.octopart.com:443/ERJ-2GEJ104X-Panasonic-datasheet-10554283.pdf?src-supplier=Newark; ComponentLink4URL: https://datasheet.octopart.com:443/ERJ-2GEJ104X-Panasonic-datasheet-5314550.pdf?src-supplier=Jameco; ComponentLink4Description: https://datasheet.octopart.com:443/ERJ-2GEJ104X-Panasonic-datasheet-5314550.pdf?src-supplier=Jameco; ComponentLink5URL: https://datasheet.octopart.com:443/ERJ-2GEJ104X-Panasonic-datasheet-136608608.pdf?src-supplier=Farnell; ComponentLink5Description: https://datasheet.octopart.com:443/ERJ-2GEJ104X-Panasonic-datasheet-136608608.pdf?src-supplier=Farnell; ComponentLink6URL: https://datasheet.octopart.com:443/ERJ-2GEJ104X-Panasonic---ECG-datasheet-15994758.pdf?src-supplier=Farnell; ComponentLink6Description: https://datasheet.octopart.com:443/ERJ-2GEJ104X-Panasonic---ECG-datasheet-15994758.pdf?src-supplier=Farnell; ComponentLink7URL: https://datasheet.octopart.com:443/ERJ-2GEJ104X-Panasonic-datasheet-5313456.pdf?src-supplier=Farnell; ComponentLink7Description: https://datasheet.octopart.com:443/ERJ-2GEJ104X-Panasonic-datasheet-5313456.pdf?src-supplier=Farnell; ComponentLink8URL: https://datasheet.octopart.com:443/ERJ-2GEJ104X-Panasonic-datasheet-147443676.pdf?src-supplier=Master+Electronics; ComponentLink8Description: https://datasheet.octopart.com:443/ERJ-2GEJ104X-Panasonic-datasheet-147443676.pdf?src-supplier=Master+Electronics; ComponentLink9URL: https://datasheet.octopart.com:443/ERJ2GEJ104X-Panasonic-datasheet-165581512.pdf?src-supplier=TME; ComponentLink9Description: https://datasheet.octopart.com:443/ERJ2GEJ104X-Panasonic-datasheet-165581512.pdf?src-supplier=TME; ComponentLink10URL: https://datasheet.octopart.com/ERJ-2GEJ104X-Panasonic-datasheet-78375410.pdf; ComponentLink10Description: https://datasheet.octopart.com/ERJ-2GEJ104X-Panasonic-datasheet-78375410.pdf; ComponentLink11URL: https://datasheet.octopart.com:443/ERJ-2GEJ104X-Panasonic-datasheet-11480398.pdf?src-supplier=Arrow+Electronics; ComponentLink11Description: https://datasheet.octopart.com:443/ERJ-2GEJ104X-Panasonic-datasheet-11480398.pdf?src-supplier=Arrow+Electronics; ComponentLink12URL: https://datasheet.octopart.com:443/ERJ-2GEJ104X-Panasonic-datasheet-118655.pdf?src-supplier=DigiKey; ComponentLink12Description: https://datasheet.octopart.com:443/ERJ-2GEJ104X-Panasonic-datasheet-118655.pdf?src-supplier=DigiKey; ComponentLink13URL: https://datasheet.octopart.com:443/ERJ2GEJ104X-Panasonic-datasheet-27908757.pdf?src-supplier=Electro+Sonic; ComponentLink13Description: https://datasheet.octopart.com:443/ERJ2GEJ104X-Panasonic-datasheet-27908757.pdf?src-supplier=Electro+Sonic; ComponentLink14URL: https://datasheet.octopart.com:443/ERJ-2GEJ104X-Panasonic-datasheet-37173568.pdf?src-supplier=Electro+Sonic; ComponentLink14Description: https://datasheet.octopart.com:443/ERJ-2GEJ104X-Panasonic-datasheet-37173568.pdf?src-supplier=Electro+Sonic
R5 = CRGP0402F33K: Res Thick Film 0402 33K Ohm 1% 0.125W(1/8W) ±100ppm/C Pad SMD T/R Automotive AEC-Q200; Manufacturer: TE Connectivity; Manufacturer Lifecycle Status: ACTIVE; Operating Supply Voltage: 50V; Power Dissipation: 125mW; Value: 33kΩ; Temperature Coefficient: 100ppm/°C; Supplier: DigiKey; Supplier Part Number: A130373CT-ND; Manufacturer Part Number: CRGP0402F33K; RoHS: Compliant; Category: Chip SMD Resistors; Stock: 30242; Pricing: 1=0.13, 10=0.061, 25=0.0468, 50=0.039, 100=0.0329, 250=0.0268, 500=0.02332, 1000=0.02056, 5000=0.01617 (USD); Case/Package: 0402; China RoHS: Non-Compliant; Composition: Thick Film; Height: 350µm; Lifecycle Status: Production; Max Operating Temperature: 155°C; Min Operating Temperature: -55°C; Mounting Technology: Surface Mount; Number of Terminals: 2; Packaging: Cut Tape; Power Rating: 125mW; REACH SVHC: Yes; Schedule B: 8533210025, 8533210025|8533210025|8533210025|8533210025|8533210025; Tolerance: 1%; Voltage Rating: 50V; Voltage Rating (DC): 50V; Width: 500µm; Working Voltage: 50V; ComponentLink1URL: https://datasheet.octopart.com:443/CRGP0402F33K-TE-Connectivity-datasheet-179147295.pdf?src-supplier=IHS; ComponentLink1Description: https://datasheet.octopart.com:443/CRGP0402F33K-TE-Connectivity-datasheet-179147295.pdf?src-supplier=IHS; ComponentLink2URL: https://datasheet.octopart.com:443/CRGP0402F33K-TE-Connectivity-datasheet-114718804.pdf?src-supplier=element14+APAC; ComponentLink2Description: https://datasheet.octopart.com:443/CRGP0402F33K-TE-Connectivity-datasheet-114718804.pdf?src-supplier=element14+APAC; ComponentLink3URL: https://datasheet.octopart.com:443/CRGP0402F33K-TE-Connectivity-datasheet-138898427.pdf?src-supplier=Upverter; ComponentLink3Description: https://datasheet.octopart.com:443/CRGP0402F33K-TE-Connectivity-datasheet-138898427.pdf?src-supplier=Upverter; ComponentLink4URL: https://sigma.octopart.com:443/114718806/technical_drawing/TE-Connectivity-CRGP0402F33K.pdf?src-supplier=Sager+Electronics; ComponentLink4Description: https://sigma.octopart.com:443/114718806/technical_drawing/TE-Connectivity-CRGP0402F33K.pdf?src-supplier=Sager+Electronics
R6 = CRGP0402F10K: Res Thick Film 0402 10K Ohm 1% 0.125W(1/8W) ±100ppm/C Pad SMD T/R Automotive AEC-Q200; Manufacturer: TE Connectivity; Manufacturer Lifecycle Status: ACTIVE; Operating Supply Voltage: 50V; Power Dissipation: 125mW; Value: 10kΩ; Temperature Coefficient: 100ppm/°C; Supplier: DigiKey; Supplier Part Number: A130367CT-ND; Manufacturer Part Number: CRGP0402F10K; RoHS: Compliant; Category: Chip SMD Resistors; Stock: 794052; Pricing: 1=0.12, 10=0.059, 25=0.0452, 50=0.0376, 100=0.0317, 250=0.0258, 500=0.0224, 1000=0.01972, 5000=0.01546 (USD); Case/Package: 0402; China RoHS: Non-Compliant; Composition: Thick Film; Height: 350µm; Lifecycle Status: Production; Max Operating Temperature: 155°C; Min Operating Temperature: -55°C; Mounting Technology: Surface Mount; Number of Terminals: 2; Packaging: Cut Tape; Power Rating: 125mW; REACH SVHC: Yes; Schedule B: 8533210025, 8533210025|8533210025|8533210025|8533210025|8533210025; Tolerance: 1%; Voltage Rating: 50V; Voltage Rating (DC): 50V; Width: 500µm; Working Voltage: 50V; ComponentLink1URL: https://datasheet.octopart.com:443/CRGP0402F10K-TE-Connectivity-datasheet-179147284.pdf?src-supplier=IHS; ComponentLink1Description: https://datasheet.octopart.com:443/CRGP0402F10K-TE-Connectivity-datasheet-179147284.pdf?src-supplier=IHS; ComponentLink2URL: https://datasheet.octopart.com:443/CRGP0402F10K-TE-Connectivity-datasheet-114718804.pdf?src-supplier=element14+APAC; ComponentLink2Description: https://datasheet.octopart.com:443/CRGP0402F10K-TE-Connectivity-datasheet-114718804.pdf?src-supplier=element14+APAC; ComponentLink3URL: https://datasheet.octopart.com:443/CRGP0402F10K-TE-Connectivity-datasheet-138898427.pdf?src-supplier=Upverter; ComponentLink3Description: https://datasheet.octopart.com:443/CRGP0402F10K-TE-Connectivity-datasheet-138898427.pdf?src-supplier=Upverter; ComponentLink4URL: https://sigma.octopart.com:443/114718806/technical_drawing/TE-Connectivity-CRGP0402F10K.pdf?src-supplier=Sager+Electronics; ComponentLink4Description: https://sigma.octopart.com:443/114718806/technical_drawing/TE-Connectivity-CRGP0402F10K.pdf?src-supplier=Sager+Electronics; ComponentLink5URL: https://datasheet.octopart.com:443/3-2176325-7-TE-Connectivity---AMP-datasheet-184935180.pdf?src-supplier=Master+Electronics; ComponentLink5Description: https://datasheet.octopart.com:443/3-2176325-7-TE-Connectivity---AMP-datasheet-184935180.pdf?src-supplier=Master+Electronics